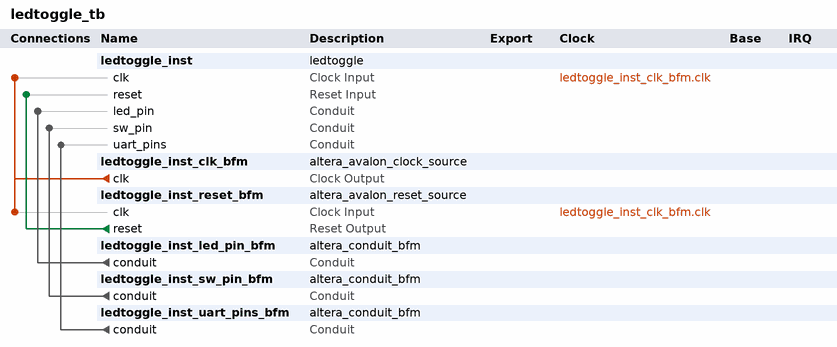
[diagram p0: system contents]
# Platform Designer (Qsys) system ledtoggle_tb, Cyclone IV E EP4CE6E22C8
# Parameters at their usual value, and those the tool derives, are not listed.
package require -exact qsys 18.1
create_system ledtoggle_tb
set_project_property DEVICE_FAMILY {Cyclone IV E}
set_project_property DEVICE EP4CE6E22C8

add_instance ledtoggle_inst ledtoggle 1.0

add_instance ledtoggle_inst_clk_bfm altera_avalon_clock_source 18.1

add_instance ledtoggle_inst_reset_bfm altera_avalon_reset_source 18.1
set_instance_parameter_value ledtoggle_inst_reset_bfm ASSERT_HIGH_RESET 0
set_instance_parameter_value ledtoggle_inst_reset_bfm INITIAL_RESET_CYCLES 50

add_instance ledtoggle_inst_led_pin_bfm altera_conduit_bfm 18.1
set_instance_parameter_value ledtoggle_inst_led_pin_bfm CLOCKED_SIGNAL false
set_instance_parameter_value ledtoggle_inst_led_pin_bfm ENABLE_RESET false
set_instance_parameter_value ledtoggle_inst_led_pin_bfm SIGNAL_DIRECTIONS input
set_instance_parameter_value ledtoggle_inst_led_pin_bfm SIGNAL_WIDTHS 8

add_instance ledtoggle_inst_sw_pin_bfm altera_conduit_bfm 18.1
set_instance_parameter_value ledtoggle_inst_sw_pin_bfm CLOCKED_SIGNAL false
set_instance_parameter_value ledtoggle_inst_sw_pin_bfm ENABLE_RESET false
set_instance_parameter_value ledtoggle_inst_sw_pin_bfm SIGNAL_DIRECTIONS output
set_instance_parameter_value ledtoggle_inst_sw_pin_bfm SIGNAL_WIDTHS 8

add_instance ledtoggle_inst_uart_pins_bfm altera_conduit_bfm 18.1
set_instance_parameter_value ledtoggle_inst_uart_pins_bfm CLOCKED_SIGNAL false
set_instance_parameter_value ledtoggle_inst_uart_pins_bfm ENABLE_RESET false
set_instance_parameter_value ledtoggle_inst_uart_pins_bfm SIGNAL_DIRECTIONS output,input
set_instance_parameter_value ledtoggle_inst_uart_pins_bfm SIGNAL_ROLES rxd,txd
set_instance_parameter_value ledtoggle_inst_uart_pins_bfm SIGNAL_WIDTHS 1,1

# connections
add_connection ledtoggle_inst_clk_bfm.clk ledtoggle_inst.clk clock
add_connection ledtoggle_inst_clk_bfm.clk ledtoggle_inst_reset_bfm.clk clock
add_connection ledtoggle_inst_reset_bfm.reset ledtoggle_inst.reset reset
add_connection ledtoggle_inst_led_pin_bfm.conduit ledtoggle_inst.led_pin conduit
add_connection ledtoggle_inst_sw_pin_bfm.conduit ledtoggle_inst.sw_pin conduit
add_connection ledtoggle_inst_uart_pins_bfm.conduit ledtoggle_inst.uart_pins conduit

set_interconnect_requirement {$system} qsys_mm.clockCrossingAdapter HANDSHAKE
set_interconnect_requirement {$system} qsys_mm.enableEccProtection FALSE
set_interconnect_requirement {$system} qsys_mm.insertDefaultSlave FALSE
set_interconnect_requirement {$system} qsys_mm.maxAdditionalLatency 1

save_system ledtoggle_tb.qsys
